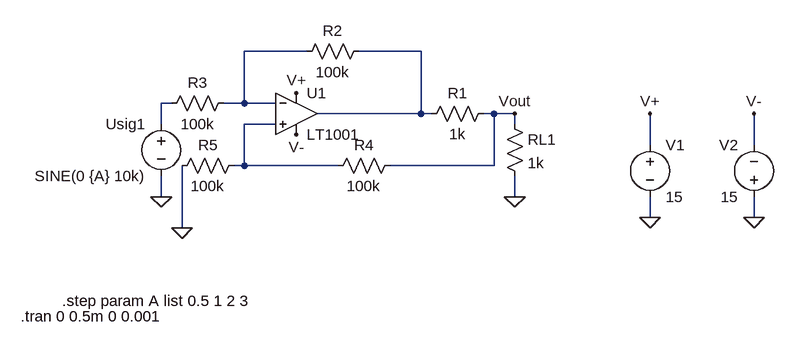
[diagram p0: schematic meros 3o B).asc]
meros 3o B).asc, the LTspice schematic file:
Version 4
SHEET 1 880 680
WIRE -112 -64 -208 -64
WIRE 64 -64 -32 -64
WIRE -320 16 -336 16
WIRE -208 16 -208 -64
WIRE -208 16 -240 16
WIRE -160 16 -208 16
WIRE 64 32 64 -64
WIRE 64 32 -96 32
WIRE 80 32 64 32
WIRE 176 32 160 32
WIRE 208 32 176 32
WIRE -336 48 -336 16
WIRE -160 48 -208 48
WIRE 208 48 208 32
WIRE 416 80 416 32
WIRE 576 80 576 32
WIRE -208 112 -208 48
WIRE -208 112 -224 112
WIRE -64 112 -208 112
WIRE 176 112 176 32
WIRE 176 112 16 112
WIRE -336 160 -336 128
WIRE 208 160 208 128
WIRE 416 192 416 160
WIRE 576 192 576 160
WIRE -304 208 -304 112
FLAG -336 160 0
FLAG 208 160 0
FLAG -304 208 0
FLAG 416 192 0
FLAG 576 192 0
FLAG 416 32 V+
FLAG -128 0 V+
FLAG 576 32 V-
FLAG -128 64 V-
FLAG 208 32 Vout
SYMBOL OpAmps\\LT1001 -128 -32 R0
SYMATTR InstName U1
SYMBOL res 176 16 R90
WINDOW 0 0 56 VBottom 2
WINDOW 3 32 56 VTop 2
SYMATTR InstName R1
SYMATTR Value 1k
SYMBOL res -16 -80 R90
WINDOW 0 0 56 VBottom 2
WINDOW 3 32 56 VTop 2
SYMATTR InstName R2
SYMATTR Value 100k
SYMBOL res -224 0 R90
WINDOW 0 0 56 VBottom 2
WINDOW 3 32 56 VTop 2
SYMATTR InstName R3
SYMATTR Value 100k
SYMBOL res 192 32 R0
SYMATTR InstName RL1
SYMATTR Value 1k
SYMBOL res 32 96 R90
WINDOW 0 0 56 VBottom 2
WINDOW 3 32 56 VTop 2
SYMATTR InstName R4
SYMATTR Value 100k
SYMBOL res -208 96 R90
WINDOW 0 0 56 VBottom 2
WINDOW 3 32 56 VTop 2
SYMATTR InstName R5
SYMATTR Value 100k
SYMBOL voltage -336 32 M0
WINDOW 123 0 0 Left 0
WINDOW 39 0 0 Left 0
SYMATTR InstName Usig1
SYMATTR Value SINE(0 {A} 10k)
SYMBOL voltage 416 64 R0
WINDOW 123 0 0 Left 0
WINDOW 39 0 0 Left 0
SYMATTR InstName V1
SYMATTR Value 15
SYMBOL voltage 576 176 R180
WINDOW 0 24 96 Left 2
WINDOW 3 24 16 Left 2
WINDOW 123 0 0 Left 0
WINDOW 39 0 0 Left 0
SYMATTR InstName V2
SYMATTR Value 15
TEXT -488 320 Left 2 !.step param A list 0.5 1 2 3
TEXT -552 344 Left 2 !.tran 0 0.5m 0 0.001

The netlist it stands for:
* meros 3o B).asc
XU1 N004 N001 V+ V- N002 LT1001  ; pins In+ In- V+ V- OUT
R1 Vout N002 1k
R2 N002 N001 100k
R3 N001 N003 100k
RL1 Vout 0 1k
R4 Vout N004 100k
R5 N004 0 100k
V§Usig1 N003 0 SINE(0 {A} 10k)
V1 V+ 0 15
V2 0 V- 15
.step param A list 0.5 1 2 3
.tran 0 0.5m 0 0.001
.lib LTC.lib
.backanno
.end